# EAGLE design batt18650parallel (EAGLE 9.5.2)
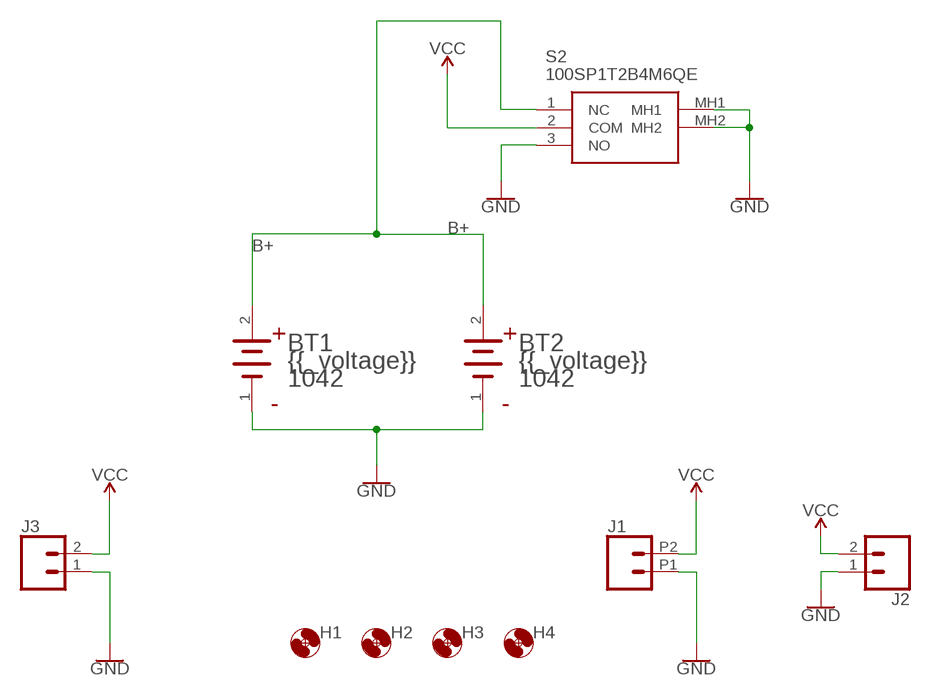
[diagram p0: schematic, sheet 1]

## Parts
BT1  KEYSTONE_1042KEYSTONE_1042_0_0  [KEYSTONE_1042_0]
BT2  KEYSTONE_1042KEYSTONE_1042_0_0  [KEYSTONE_1042_0]
H1  MOUNTING_HOLE4_NP  [4_40]
H2  MOUNTING_HOLE4_NP  [4_40]
H3  MOUNTING_HOLE4_NP  [4_40]
H4  MOUNTING_HOLE4_NP  [4_40]
J1  CONN_022.54_SCREW_ROUND  [1X02_2.54_SCREWTERM_ROUND]
J2  CONN_02-JST-2MM-SMT  [JST-2-SMD]
J3  CONN_023.5MM_ROUND  [SCREWTERMINAL-3.5MM-2_ROUND]
S2  100SP1T2B4M6QE  [100SP1T2B4M6QE]

## Nets
B+: BT1.2(ANODE) BT2.2(ANODE) S2.1(NC)
GND: BT1.1(CATHODE) BT2.1(CATHODE) J1.P1 J2.1 J3.1 S2.3(NO) S2.MH1 S2.MH2
VCC: J1.P2 J2.2 J3.2 S2.2(COM)

## Library data of the parts
BT1 BT2 = Keystone - 1042:KEYSTONE_1042: PC BATTERY HOLDER 18650; CENTROID_NOT_SPECIFIED: No; DATASHEET: http://www.keyelco.com/product-pdf.cfm?p=918; DIGIKEY_DESCRIPTION: BATT HOLDER BATTERY 1CELL 18650 SMD; DIGIKEY_PART_NUMBER: 36-1042-ND; IPC_LAND_PATTERN_NAME: CAPC200125X45; LEAD_FREE: yes; MF: Keystone; MOUSER_PART_NUMBER: 534-1042; MPN: 1042; PACKAGE: PTH_BAT_HOLDER_18650; PREFIX: BT; ROHS: yes
H1-H4 = bschulz:MOUNTING_HOLE: Genaric Mechanical Mounting Hole Hole diameter based on max body diameter + 15% Keepout ring is for diameter of socket cap screw (minimum required clearance) TPlace ring is for diameter of pan head screw (recomended clearance) Specifications: Socket Cap <http://fastener-express.com/fastener-technical/SocketscapSS-Alloy.pdf> Button Head Socket Cap <http://fastener-express.com/fastener-technical/Button-Socket-alloy.pdf> Pan Head <http://fastener-express.com/fastener-technical/pan-machine-Screws.pdf>
J1 = bschulz:CONN_02: Genaric 2 terminal header SCREW_2.54 <https://www.digikey.com/product-detail/en/on-shore-technology-inc/OSTVN02A150/ED10561-ND/1588862> 39532_RA <https://www.digikey.com/product-detail/en/molex/0395321002/WM7845-ND/1280696>; DIGIKEY: ED10561-ND; MF: OnShore; MPN: OSTVN02A150
J2 = bschulz:CONN_02: Genaric 2 terminal header SCREW_2.54 <https://www.digikey.com/product-detail/en/on-shore-technology-inc/OSTVN02A150/ED10561-ND/1588862> 39532_RA <https://www.digikey.com/product-detail/en/molex/0395321002/WM7845-ND/1280696>; DIGIKEY: 455-1749-1-ND; MF: JST; MPN: S2B-PH-SM4-TB(LF)(SN); PROD_ID: CONN-11443
J3 = bschulz:CONN_02: Genaric 2 terminal header SCREW_2.54 <https://www.digikey.com/product-detail/en/on-shore-technology-inc/OSTVN02A150/ED10561-ND/1588862> 39532_RA <https://www.digikey.com/product-detail/en/molex/0395321002/WM7845-ND/1280696>; DIGIKEY: ED2635-ND; MF: OnShore; MPN: OSTTE020161
S2 = 100SP1T2B4M6QE:100SP1T2B4M6QE: E-SWITCH - 100SP1T2B4M6QE - SWITCH, TOGGLE, SPDT, 5A, 120VAC, 28VDC Source: Datasheet <http://spec_sheets.e-switch.com/specs/T111069.pdf>; DESCRIPTION: E-SWITCH - 100SP1T2B4M6QE - SWITCH, TOGGLE, SPDT, 5A, 120VAC, 28VDC; HEIGHT: 6.86mm; MANUFACTURER_NAME: E-Switch; MANUFACTURER_PART_NUMBER: 100SP1T2B4M6QE; MOUSER_PART_NUMBER: 612-100-A2461; MOUSER_PRICE-STOCK: https://www.mouser.com/Search/Refine.aspx?Keyword=612-100-A2461

## Board
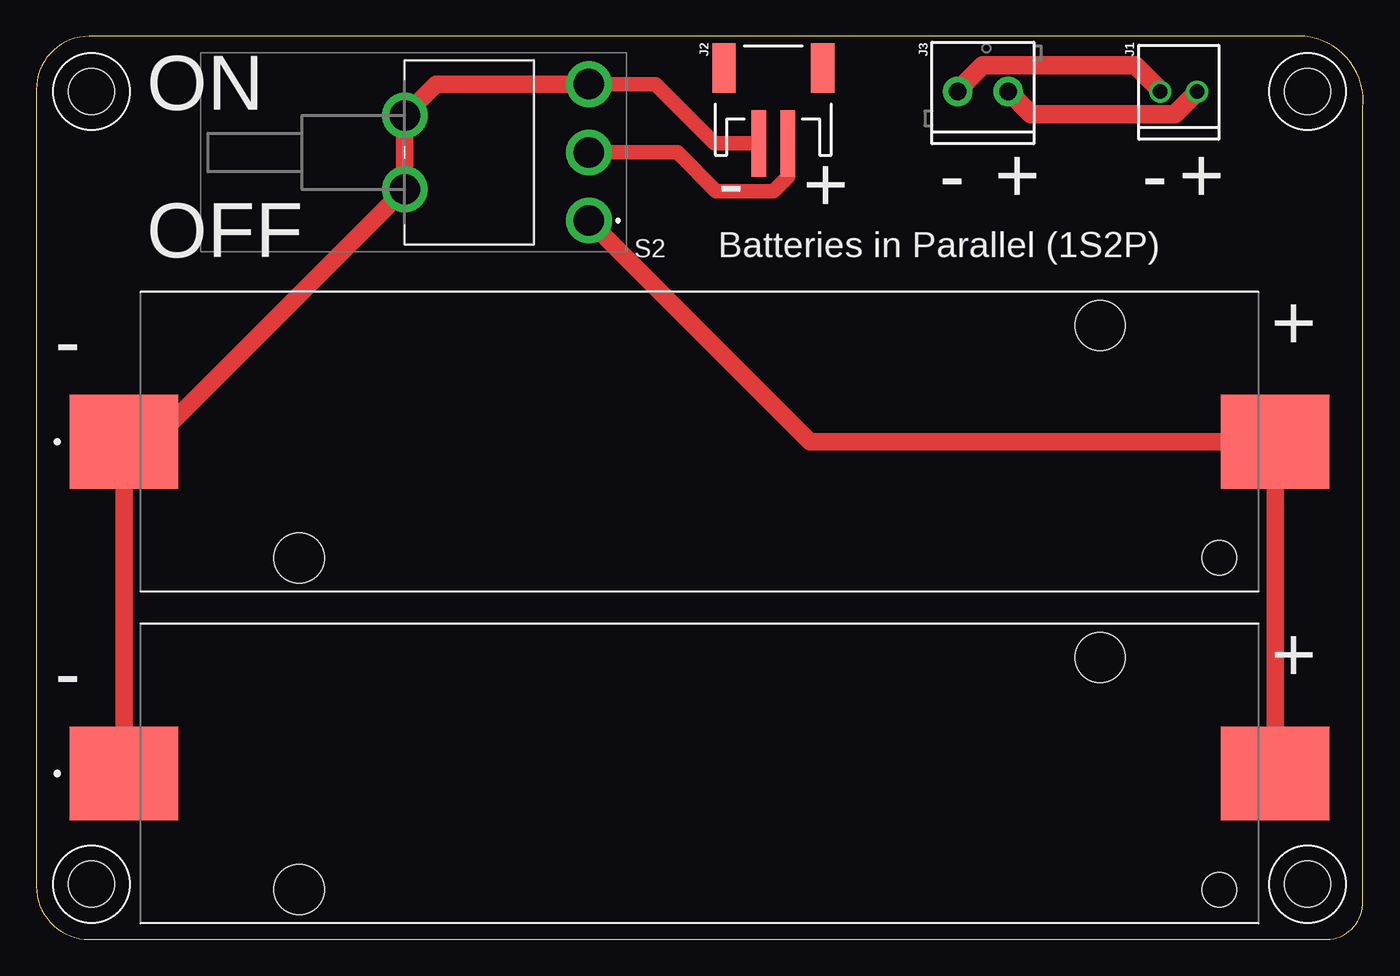
[diagram p1: board, top side]
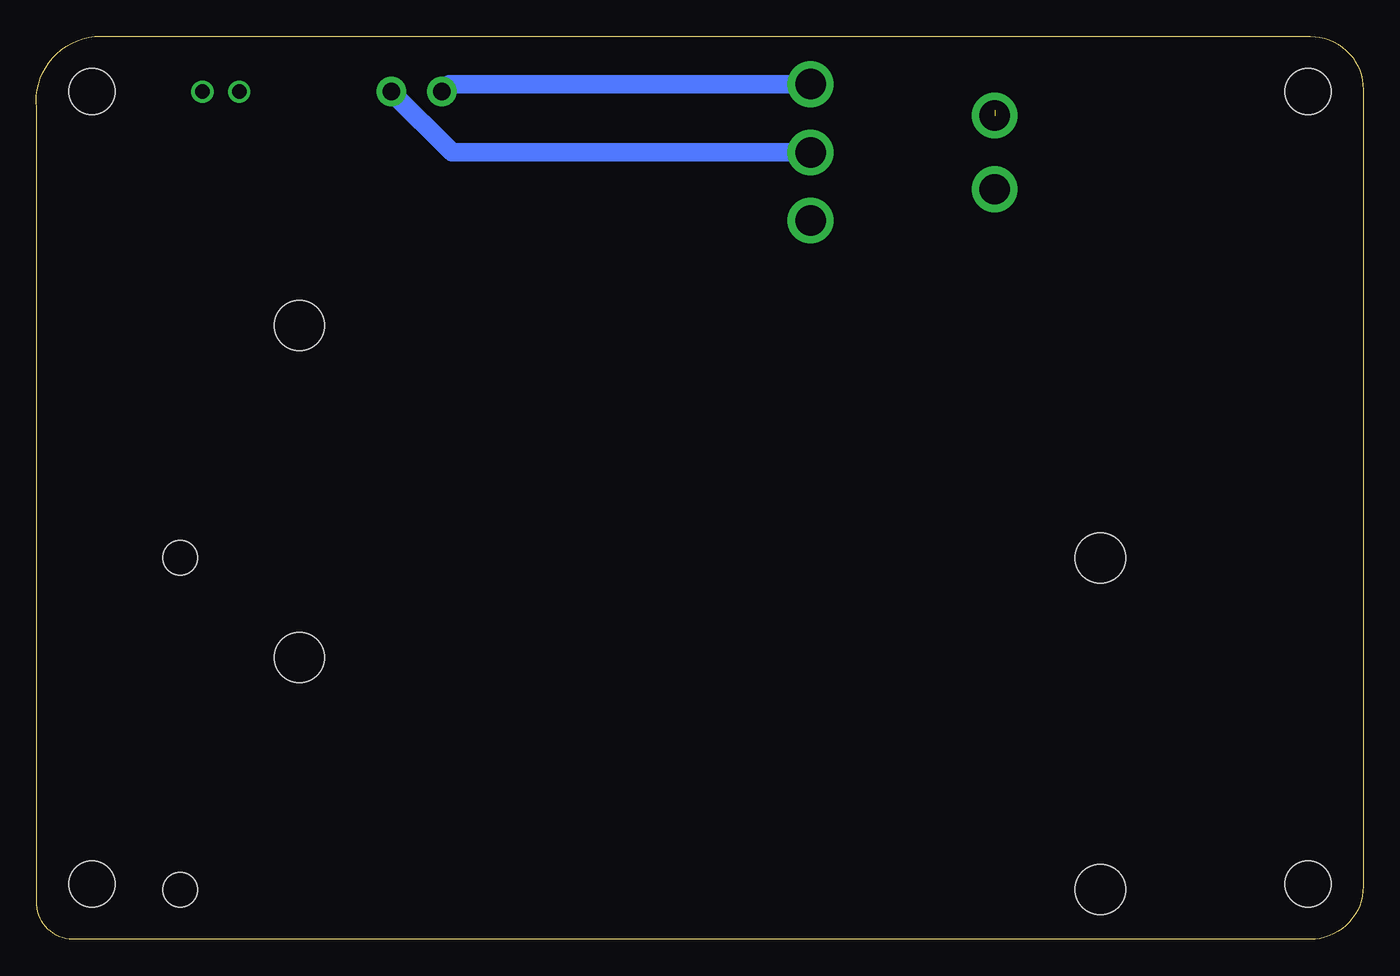
[diagram p2: board, bottom side, seen from below]

Size 91.46 x 62.23 mm. Coordinates in mm from the lower left corner, seen from the top.
Outline: 0,58.57 0,3.66 arc90 3.66,0 88.72,0 arc90 91.44,2.39 91.44,57.3 arc90 87.45,62.23 3.66,62.23 arc90 0,58.57
Copper layers (1*16): Top 0.035559375mm / dielectric 1.6mm / Bottom 0.035559375mm
Design rules "oshpark-2layer": minimum track width 6mil, minimum drill 10mil, track to track 6mil, track to pad 6mil, pad to pad 6mil, via to via 6mil, smd to smd 6mil, copper to edge 15mil, drill to drill 6mil, minimum pad ring 5mil, minimum via ring 5mil, stop-mask expansion 2.5mil, vias tented up to drill 0mil, thermal gap 10mil

### Footprints (pad centres in the part's own frame; a part is rotated, then mirrored left to right if it is on the bottom)
KEYSTONE_1042_0 = smd 7.46 x 6.47: 1 -39.67,0; 2 39.67,0 | hole 3.45: -27.6,-8; 27.6,8 | hole 2.39: 35.82,-8
4_40 = hole 3.175: 0,0
1X02_2.54_SCREWTERM_ROUND = drill 1.016: P1 1.27,0; P2 -1.27,0
JST-2-SMD = smd 1 x 4.6: 1 -1,-3.7; 2 1,-3.7 | smd 1.6 x 3.4: NC1 -3.4,1.5; NC2 3.4,1.5
SCREWTERMINAL-3.5MM-2_ROUND = drill 1.2 pad 2.032: 1 0,0; 2 3.5,0
100SP1T2B4M6QE = drill 2.1 pad 3.15: 1 0,0; 2 4.7,0; 3 9.4,0; MH1 2.16,12.7; MH2 7.24,12.7

### Placement (x,y rotation side)
BT1  45.72,11.43 0 top
BT2  45.72,34.29 0 top
H1  3.81,58.42 0 top
H2  3.81,3.81 0 top
H3  87.63,58.42 0 top
H4  87.63,3.81 0 top
J1  78.74,58.42 180 top
J2  50.8,58.55 0 top
J3  63.5,58.42 0 top
S2  38.1,49.53 90 top

### Tracks (layer width: path | path; a pad name or v marks a point on that pad's centre or on a via)
B+
  Top 1.219: BT1.2 BT2.2 53.34,34.29 S2.1
GND  (1 unrouted)
  Top 1.016: S2.3 42.67,58.93 46.75,54.85 J2.1
  Top 1.219: BT1.1 BT2.1 6.49,34.29 arc45 9.07,35.37 S2.MH1 25.4,57.15 | S2.MH2 27.56,58.93 S2.3 38.98,58.93
  Top 1.27: J3.1 63.5,58.49 65.24,60.23 75.75,60.23 77.47,58.51 J1.P1
  Bottom 1.27: S2.3 62.99,58.93 J3.1
VCC
  Top 1.016: S2.2 44.2,54.23 46.86,51.57 50.8,51.57 51.8,52.57 J2.2
  Top 1.27: J1.P2 80.01,58.39 78.49,56.88 68.57,56.88 67.02,58.42 J3.2
  Bottom 1.27: S2.2 62.81,54.23 J3.2

### Text on the board
tPlace: ON | - | + | - | + | - | + | OFF | Batteries in Parallel (1S2P) | + | - | + | -